# EAGLE design valve+camera (EAGLE 7.1.0)
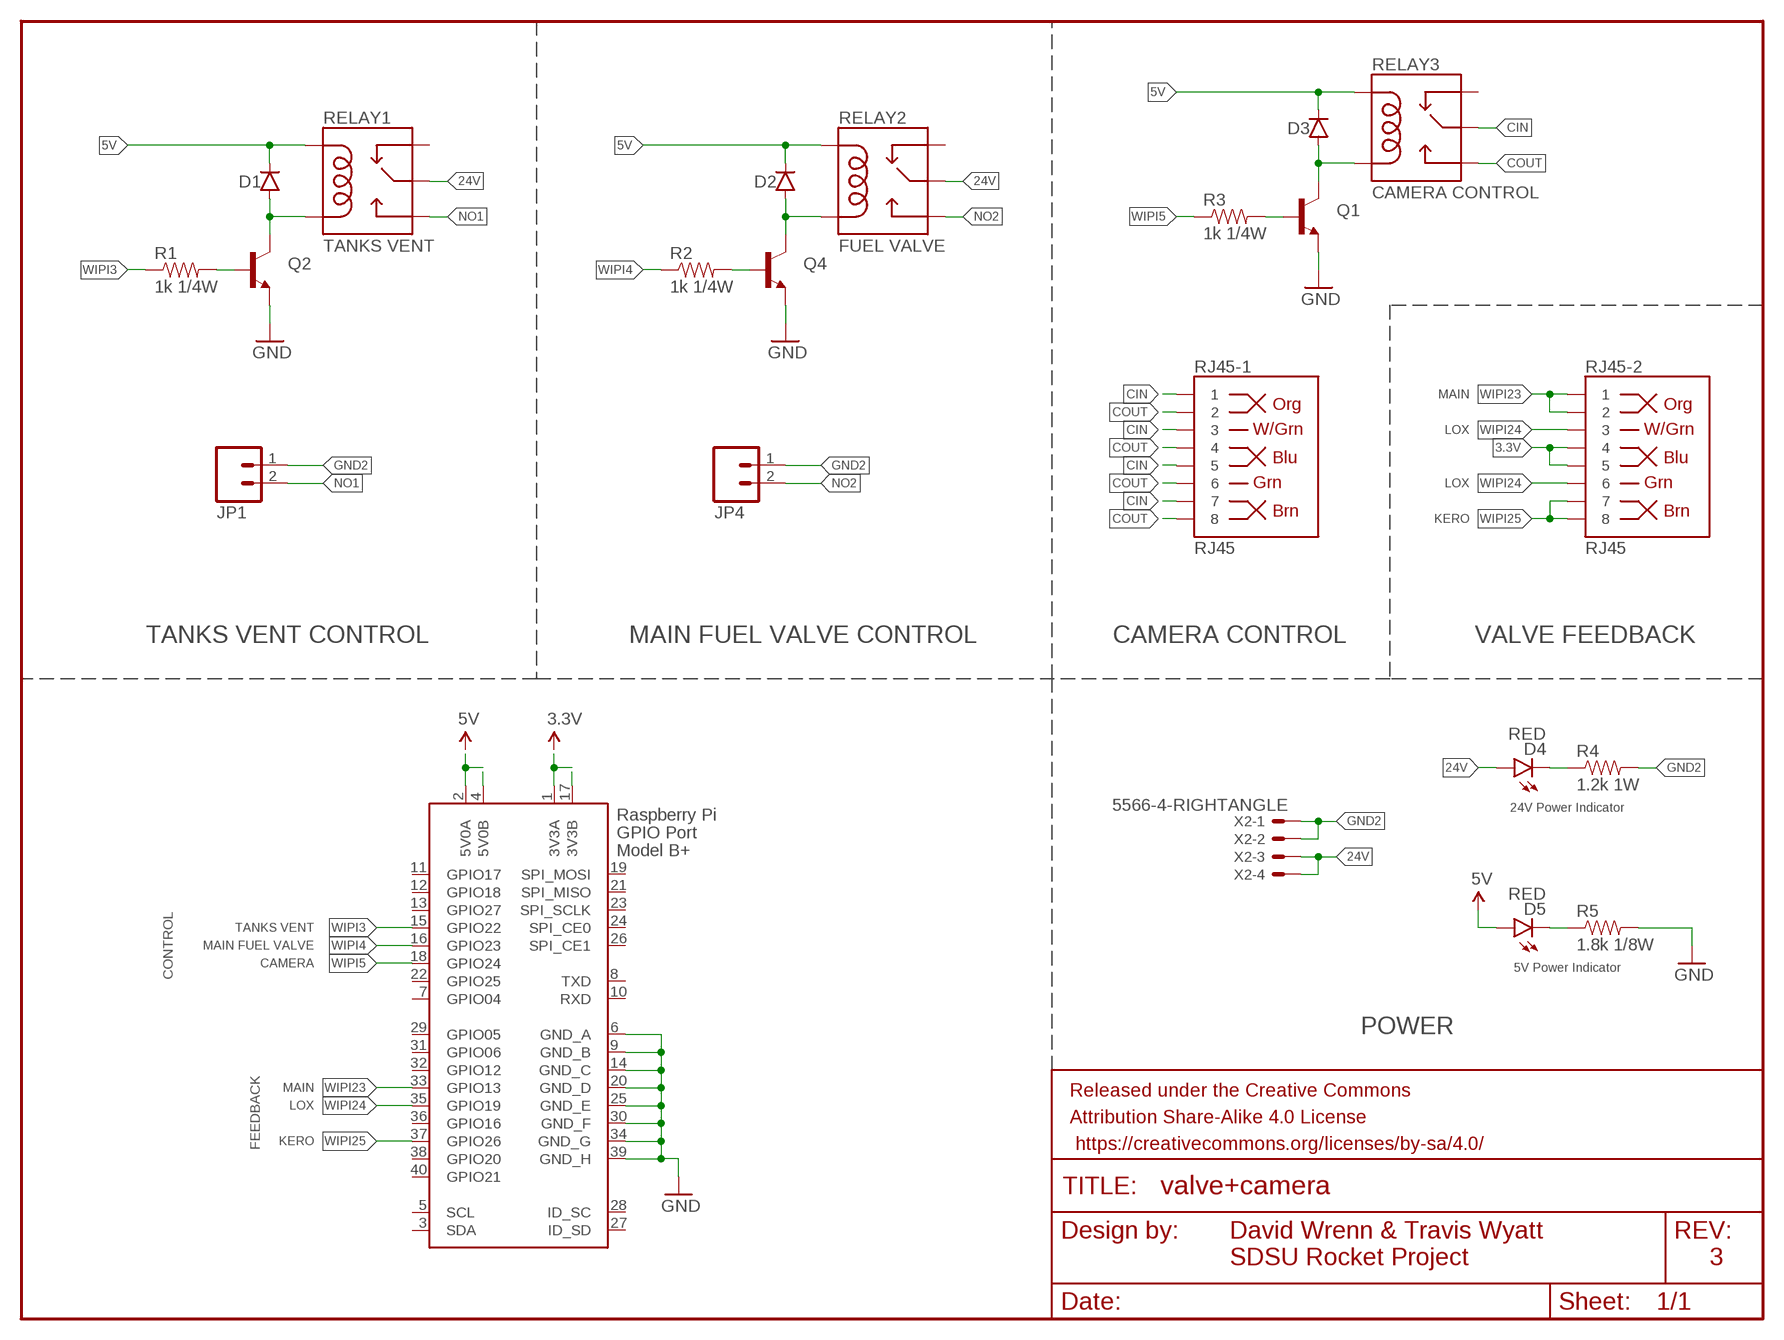
[diagram p0: schematic, sheet 1]

## Parts
D1  DIODESOD123  [SOD-123]
D2  DIODESOD123  [SOD-123]
D3  DIODESOD123  [SOD-123]
D4  RED  LED0603  [LED-0603]
D5  RED  LED0603  [LED-0603]
FRAME1  FRAME-LETTER  [CREATIVE_COMMONS]
JP1  M02-JST-2-PTH-NO_SILK  [JST-2-PTH-NS]
JP4  M02-JST-2-PTH-NO_SILK  [JST-2-PTH-NS]
Q1  TRANSISTOR_NPNSOT23-3  [SOT23-3]
Q2  TRANSISTOR_NPNSOT23-3  [SOT23-3]
Q4  TRANSISTOR_NPNSOT23-3  [SOT23-3]
R1  1k 1/4W  RESISTOR0603-RES  [0603-RES]
R2  1k 1/4W  RESISTOR0603-RES  [0603-RES]
R3  1k 1/4W  RESISTOR0603-RES  [0603-RES]
R4  1.2k 1W  RESISTOR2512  [R2512]
R5  1.8k 1/8W  RESISTOR0603-RES  [0603-RES]
RELAY1  TANKS VENT  RELAYPTH  [RELAY-G5Q]
RELAY2  FUEL VALVE  RELAYPTH  [RELAY-G5Q]
RELAY3  CAMERA CONTROL  RELAYPTH  [RELAY-G5Q]
RJ45-1  RJ45  RJ45-8PTH  [RJ45-8]
RJ45-2  RJ45  RJ45-8PTH  [RJ45-8]
X1  RASPI_BOARD_B+#_H  [RASPI_BOARD_B+HAT]
X2  5566-4-RIGHTANGLE  [5566-4]

## Nets
3.3V: RJ45-2.4 RJ45-2.5 X1.1(3V3A) X1.17(3V3B)
5V: D1.C D2.C D3.C D5.A RELAY1.5(COIL1) RELAY2.5(COIL1) RELAY3.5(COIL1) X1.2(5V0A) X1.4(5V0B)
24V: D4.A RELAY1.2(MAIN) RELAY2.2(MAIN) X2.3 X2.4
CIN: RELAY3.2(MAIN) RJ45-1.1 RJ45-1.3 RJ45-1.5 RJ45-1.7
COUT: RELAY3.3(NO) RJ45-1.2 RJ45-1.4 RJ45-1.6 RJ45-1.8
GND: Q1.2(E) Q2.2(E) Q4.2(E) R5.2 X1.6(GND_A) X1.9(GND_B) X1.14(GND_C) X1.20(GND_D) X1.25(GND_E) X1.30(GND_F) X1.34(GND_G) X1.39(GND_H)
GND2: JP1.1 JP4.1 R4.2 X2.1 X2.2
N$1: D4.C R4.1
N$2: D5.C R5.1
N$3: Q2.1(B) R1.2
N$4: D1.A Q2.3(C) RELAY1.1(COIL2)
N$5: Q1.1(B) R3.2
N$6: D3.A Q1.3(C) RELAY3.1(COIL2)
N$7: Q4.1(B) R2.2
N$8: D2.A Q4.3(C) RELAY2.1(COIL2)
NO1: JP1.2 RELAY1.3(NO)
NO2: JP4.2 RELAY2.3(NO)
WIPI3: R1.1 X1.15(GPIO22)
WIPI4: R2.1 X1.16(GPIO23)
WIPI5: R3.1 X1.18(GPIO24)
WIPI23: RJ45-2.1 RJ45-2.2 X1.33(GPIO13)
WIPI24: RJ45-2.3 RJ45-2.6 X1.35(GPIO19)
WIPI25: RJ45-2.7 RJ45-2.8 X1.37(GPIO26)
Unconnected: RELAY1.4(NC) RELAY2.4(NC) RELAY3.4(NC) X1.3(SDA) X1.5(SCL) X1.7(GPIO04) X1.8(TXD) X1.10(RXD) X1.11(GPIO17) X1.12(GPIO18) X1.13(GPIO27) X1.19(SPI_MOSI) X1.21(SPI_MISO) X1.22(GPIO25) X1.23(SPI_SCLK) X1.24(SPI_CE0) X1.26(SPI_CE1) X1.27(ID_SD) X1.28(ID_SC) X1.29(GPIO05) X1.31(GPIO06) X1.32(GPIO12) X1.36(GPIO16) X1.38(GPIO20) X1.40(GPIO21)

## Notes on the sheet
- MAIN
- LOX
- LOX
- KERO
- TANKS VENT CONTROL | MAIN FUEL VALVE CONTROL | CAMERA CONTROL | VALVE FEEDBACK
- 24V Power Indicator
- TANKS VENT
- CONTROL | MAIN FUEL VALVE
- CAMERA | 5V Power Indicator
- POWER
- MAIN
- LOX
- FEEDBACK
- KERO
- David Wrenn & Travis Wyatt
- SDSU Rocket Project
- 3

## Library data of the parts
D1-D3 = SparkFun-DiscreteSemi:DIODE: Diode These are standard reverse protection diodes and small signal diodes. SMA package can handle up to about 1A. SOD-323 can handle about 200mA. What the SOD-323 package when ordering, there are some mfgs out there that are 5-pin packages.
D4 D5 = SparkFun-LED:LED: LEDs Standard schematic elements and footprints for 5mm, 3mm, 1206, and 0603 sized LEDs. 5mm - Spark Fun Electronics SKU : COM-00529 (and others)
FRAME1 = SparkFun-Aesthetics:FRAME-LETTER: Schematic Frame Standard 8.5x11 US Letter frame; DESIGNER: NAME; VERSION: v01
JP1 JP4 = SparkFun-Connectors:M02: Standard 2-pin 0.1" header. Use with - straight break away headers ( PRT-00116) - right angle break away headers (PRT-00553) - swiss pins (PRT-00743) - machine pins (PRT-00117) - female headers (PRT-00115) Molex polarized connector foot print use with: PRT-08233 with associated crimp pins and housings. 2.54_SCREWTERM for use with PRT-10571. 3.5mm Screw Terminal footprints for PRT-08084 5mm Screw Terminal footprints for use with PRT-08432
Q1 Q2 Q4 = SparkFun-DiscreteSemi:TRANSISTOR_NPN: Generic NPN BJT MMBT2222A - TRANS-08049 (SOT-23, 1A 40V) MPSA42 - TRANS-09116 (SOT-23, 500mA 300V) MMBT5088LT1G - TRANS-11160 (SOT-23, 50 mA 30V) BC547 - COM-08928 <http://www.sparkfun.com/products/8928> (TO-92 45V 100mA) (1.Collector 2.Base 3.Emitter) 2N3904 - COM-00521 <http://www.sparkfun.com/products/521> (TO-92 40V 200mA) (1.Emitter 2.Base 3.Collector) P2N2222A - COM-12852 <http://www.sparkfun.com/products/12852> (TO-92 40V 600mA) (1.Collector 2.Base 3.Emitter); PROD_ID: TRANS-08049
R1-R3 = SparkFun-Passives:RESISTOR: Resistor Basic schematic elements and footprints for 0603, 1206, and PTH resistors.
R4 R5 = SparkFun-Resistors:RESISTOR: Resistor Basic schematic elements and footprints for 0603, 1206, and PTH resistors.
RELAY1-RELAY3 = SparkFun-Electromechanical:RELAY: SPDT relay (COM-00101)
RJ45-1 RJ45-2 = SparkFun-Connectors:RJ45-8: RJ45 Jack Simple RJ45, 8-pin connection - connector for common Cat5, Cat5e, and Cat6 Ethernet cables. Footprint not yet proven in production. Connector sku is PRT-00643; Breakout PCB sku is BOB-00716.; PROD_ID: CONN-08506
X1 = raspberrypi_bastelstube_v13:RASPI_BOARD_B+#: Raspberry Pi GPIO connector with markings for the outer dimensions of the Raspberry Pi board model B+ with different sets of drill holes or mounting pads All pins connected
X2 = SDSURocket-Connectors:5566-4: Mini FIT connector 4 pol Source: http://www.molex.com; OC_FARNELL: unknown; OC_NEWARK: unknown

## Net classes
1 5V Power: width 0.61 mm

## Board
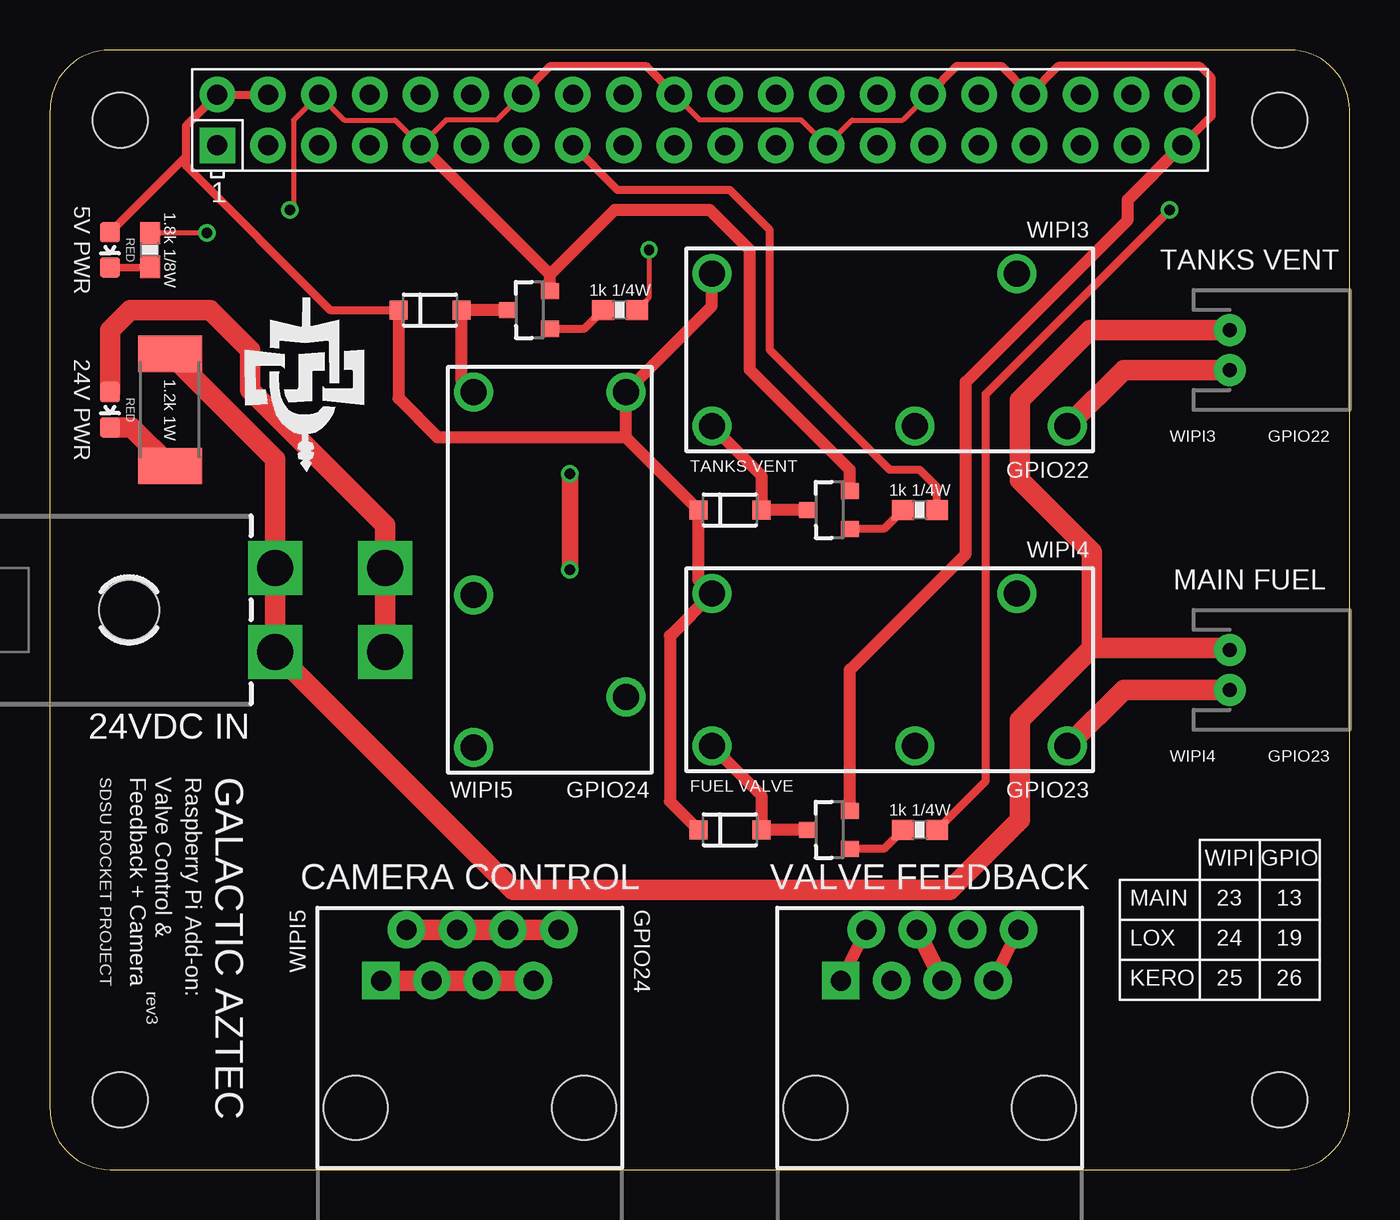
[diagram p1: board, top side]
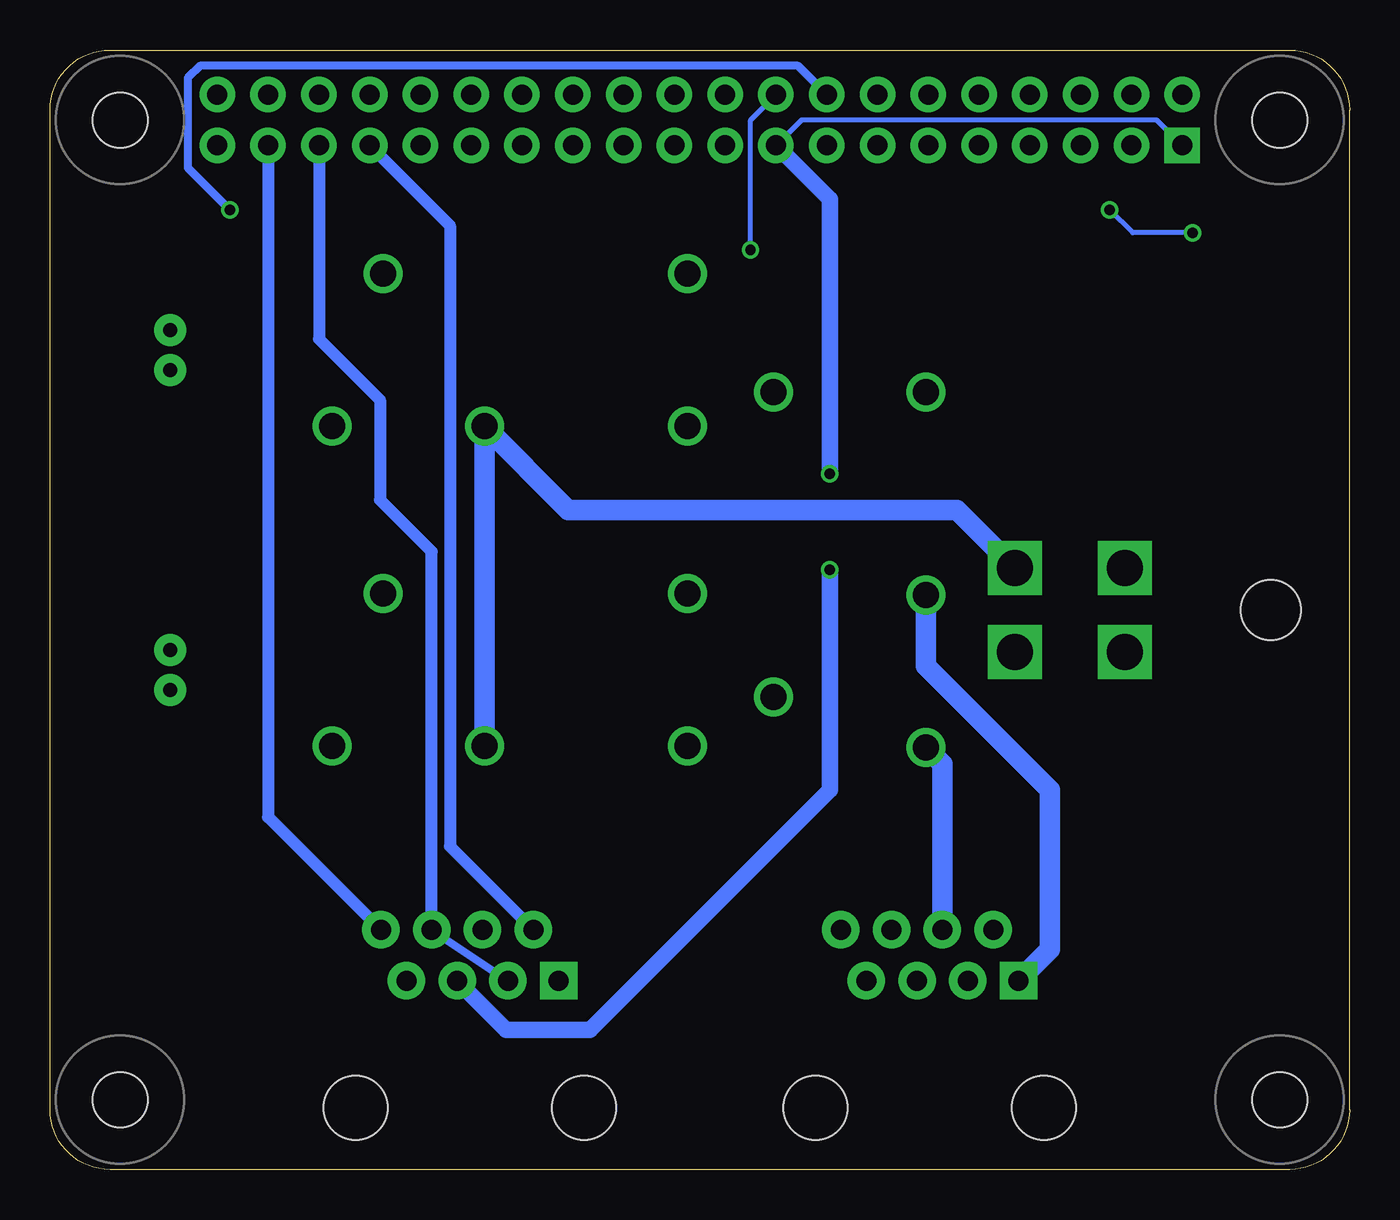
[diagram p2: board, bottom side, seen from below]

Size 65 x 56 mm. Coordinates in mm from the lower left corner, seen from the top.
Copper layers (1*16): Top 0.0356mm / dielectric 1.5011mm / Bottom 0.0356mm
Design rules "SparkFunBestPractices *": minimum track width 10mil, minimum drill 13mil, track to track 10mil, track to pad 10mil, pad to pad 10mil, via to via 10mil, smd to smd 10mil, copper to edge 15mil, drill to drill 12mil, minimum pad ring 7mil, minimum via ring 7mil, stop-mask expansion 3mil, vias tented up to drill 0mil, thermal gap 10mil

### Footprints (pad centres in the part's own frame; a part is rotated, then mirrored left to right if it is on the bottom)
SOD-123 = smd 0.9 x 0.95: A 1.575,0; C -1.575,0
LED-0603 = smd 1 x 1: A 0,-0.877; C 0,0.877
JST-2-PTH-NS = drill 0.7 pad 1.6: 1 -1,0; 2 1,0
SOT23-3 = smd 0.8 x 0.9: 1 -0.95,-1; 2 0.95,-1; 3 0,1.1
0603-RES = smd 1.1 x 1: 1 -0.85,0; 2 0.85,0
R2512 = smd 1.8 x 3.2: 1 -2.8,0; 2 2.8,0
RELAY-G5Q = drill 1.3: 1 8.89,3.81; 2 -1.27,3.81; 3 -8.89,3.81; 4 -6.35,-3.81; 5 8.89,-3.81
RJ45-8 = drill 1 pad 1.88 square: 1 -4.445,6.35 | drill 1 pad 1.88: 2 -3.175,8.89; 3 -1.905,6.35; 4 -0.635,8.89; 5 0.635,6.35; 6 1.905,8.89; 7 3.175,6.35; 8 4.445,8.89 | hole 3.2: -5.715,0; 5.715,0
RASPI_BOARD_B+HAT = drill 1 pad 1.778 square: 1 8.37,51.23 | drill 1 pad 1.778: 2 8.37,53.77; 3 10.91,51.23; 4 10.91,53.77; 5 13.45,51.23; 6 13.45,53.77; 7 15.99,51.23; 8 15.99,53.77; 9 18.53,51.23; 10 18.53,53.77; 11 21.07,51.23; 12 21.07,53.77; 13 23.61,51.23; 14 23.61,53.77; 15 26.15,51.23; 16 26.15,53.77; 17 28.69,51.23; 18 28.69,53.77; 19 31.23,51.23; 20 31.23,53.77; 21 33.77,51.23; 22 33.77,53.77; 23 36.31,51.23; 24 36.31,53.77; 25 38.85,51.23; 26 38.85,53.77; 27 41.39,51.23; 28 41.39,53.77; 29 43.93,51.23; 30 43.93,53.77; 31 46.47,51.23; 32 46.47,53.77; 33 49.01,51.23; 34 49.01,53.77; 35 51.55,51.23; 36 51.55,53.77; 37 54.09,51.23; 38 54.09,53.77; 39 56.63,51.23; 40 56.63,53.77 | hole 2.75: 3.5,3.5; 3.5,52.5; 61.5,3.5; 61.5,52.5
5566-4 = drill 1.8 square: 1 2.1,-2.75; 2 -2.1,-2.75; 3 2.1,2.75; 4 -2.1,2.75 | hole 3: 0,-10.05

### Placement (x,y rotation side)
D1  34,33 0 top
D2  34,17 0 top
D3  19,43 0 top
D4  3,38 180 top
D5  3,46 180 top
FRAME1  0,-16 0 top  (outside the outline)
JP1  59,41 270 top
JP4  59,25 270 top
Q1  24,43 90 top
Q2  39,33 90 top
Q4  39,17 90 top
R1  43.5,33 180 top
R2  43.5,17 180 top
R3  28.5,43 180 top
R4  6,38 90 top
R5  5,46 90 top
RELAY1  42,41 180 top
RELAY2  42,25 180 top
RELAY3  25,30 90 top
RJ45-1  21,3.1 0 top
RJ45-2  44,3.1 0 top
X1  0,0 0 top
X2  14,28 270 top

### Tracks (layer width: path | path; a pad name or v marks a point on that pad's centre or on a via)
3.3V  (via drill 0.51)
  Top 0.813: v26,30 v26,34.8 | RJ45-2.5 RJ45-2.4
  Bottom 0.254: X1.1 9.64,52.5 27.42,52.5 X1.17
  Bottom 0.813: RJ45-2.5 42.19,7 38,7 26,19 v26,30 | v26,34.8 26,48.54 X1.17
5V
  Top 0.406: D5.A 6.8,50.68 | 6.8,50.68 6.8,52.2 X1.2 X1.4 | 6.8,50.68 6.8,50.2 14,43 D3.C
  Top 0.61: 28.81,36.62 D1.C 32.42,29.5 RELAY2.5 31,26.7 31,18.43 D2.C | 28.81,36.62 RELAY3.5 33.11,43.19 RELAY1.5 | D3.C 17.43,38.58 19.39,36.62 28.81,36.62
24V
  Top 1.016: D4.A 3,42 4,43 8,43 10,41 10,39 16.75,32.25 X2.4 X2.3
  Bottom 1.016: RELAY2.2 RELAY1.2 39.08,33 19.65,33 X2.4
CIN
  Top 1.016: RJ45-1.7 RJ45-1.5 RJ45-1.3 RJ45-1.1
  Bottom 1.016: RJ45-1.1 15,11.01 15,19 21.19,25.19 RELAY3.2
COUT
  Top 1.016: RJ45-1.2 RJ45-1.4 RJ45-1.6 RJ45-1.8
  Bottom 1.016: RELAY3.3 20.36,20.29 RJ45-1.4
GND  (via drill 0.51)
  Top 0.254: X1.14 22.34,52.5 19.8,52.5 X1.9 17.26,52.5 14.72,52.5 X1.6 12.18,52.5 12.18,48.18 v12,48 | X1.20 32.5,52.5 37.58,52.5 X1.25 40.12,52.5 42.66,52.5 X1.30 | R5.2 v7.85,46.85
  Top 0.406: X1.14 25.04,55.2 29.8,55.2 X1.20 | X1.30 45.36,55.2 47.58,55.2 X1.34 50.44,55.2 57.5,55.2 58.1,54.6 58.1,52.7 X1.39
  Top 0.61: Q1.2 25,44.76 | 25,44.76 X1.9 | Q4.2 40,25 45.8,30.8 45.8,39.4 53.9,47.5 53.9,48.5 X1.39 | Q2.2 40,35 35,40 35,46 33,48 28.24,48 25,44.76
  Bottom 0.254: v7.85,46.85 10.85,46.85 v12,48
GND2
  Top 1.016: R4.2 11.25,35.55 X2.2 X2.1 23.15,14 45,14 48.5,17.5 48.5,22.5 52.1,26.1 | 52.1,26.1 52.1,30.9 48.5,34.5 48.5,38.5 52,42 JP1.1 | JP4.1 58.9,26.1 52.1,26.1
N$1
  Top 1.016: D4.C 4.08,37.12 R4.1
N$2
  Top 0.406: D5.C R5.1
N$3
  Top 0.406: R1.2 41.7,32.05 Q2.1
N$4
  Top 0.61: RELAY1.1 35.58,34.73 D1.A Q2.3
N$5
  Top 0.406: R3.2 26.7,42.05 Q1.1
N$6
  Top 0.61: Q1.3 D3.A 20.57,39.51 RELAY3.1
N$7
  Top 0.406: R2.2 41.7,16.05 Q4.1
N$8
  Top 0.61: Q4.3 D2.A 35.58,18.73 RELAY2.1
NO1
  Top 1.016: RELAY1.3 53.7,40 JP1.2
NO2
  Top 1.016: RELAY2.3 53.7,24 JP4.2
WIPI3
  Top 0.406: R1.1 44.35,34.15 43.5,35 42,35 36,41 36,47 34,49 28.38,49 X1.15
WIPI4  (via drill 0.51)
  Top 0.406: R2.1 46.8,19.45 46.8,38.8 v56,48
  Bottom 0.406: X1.16 27.58,55.2 57.5,55.2 58.1,54.6 58.1,50.1 v56,48
WIPI5  (via drill 0.51)
  Top 0.254: v29.96,46 29.96,43.61 R3.1
  Bottom 0.254: v29.96,46 29.96,52.5 X1.18
WIPI23
  Top 0.61: RJ45-2.1 RJ45-2.2
  Bottom 0.61: X1.33 45,47.22 45,16.16 RJ45-2.2
WIPI24
  Bottom 0.406: RJ45-2.6 RJ45-2.3
  Bottom 0.61: X1.35 51.55,41.55 48.5,38.5 48.5,33.5 45.91,30.91 RJ45-2.6
WIPI25
  Top 0.61: RJ45-2.7 RJ45-2.8
  Bottom 0.61: X1.37 54.09,17.64 RJ45-2.8

### Text on the board
tNames: WIPI3 | 5V PWR | TANKS VENT | 24V PWR | WIPI3 | GPIO22 | GPIO22 | WIPI4 | MAIN FUEL | 24VDC IN | WIPI4 | GPIO23 | SDSU ROCKET PROJECT | Feedback + Camera | Valve Control & | Raspberry Pi Add-on: | GALACTIC AZTEC | WIPI5 | GPIO24 | GPIO23 | WIPI | GPIO | CAMERA CONTROL | VALVE FEEDBACK | MAIN | 23 | 13 | WIPI5 | GPIO24 | LOX | 24 | 19 | KERO | 25 | 26 | rev3